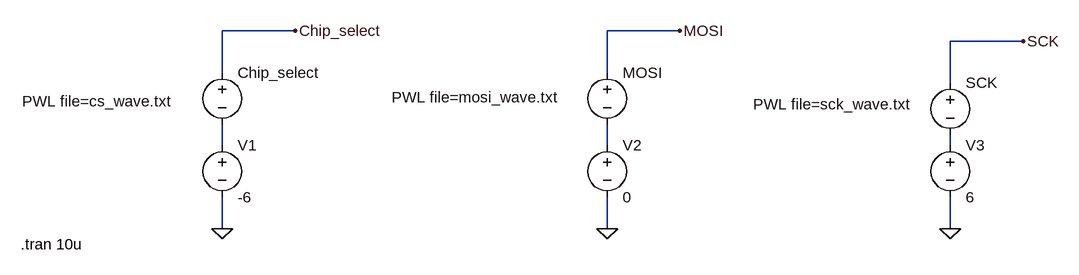
[diagram p0: schematic SPI_waveform_test.asc]
SPI_waveform_test.asc, the LTspice schematic file:
Version 4
SHEET 1 3484 1816
WIRE 144 -256 32 -256
WIRE 736 -256 624 -256
WIRE 1264 -240 1152 -240
WIRE 32 -192 32 -256
WIRE 624 -192 624 -256
WIRE 1152 -176 1152 -240
WIRE 32 -80 32 -112
WIRE 624 -80 624 -112
WIRE 1152 -80 1152 -96
WIRE 32 48 32 0
WIRE 624 48 624 0
WIRE 1152 48 1152 0
FLAG 624 48 0
FLAG 1152 48 0
FLAG 32 48 0
FLAG 736 -256 MOSI
FLAG 1264 -240 SCK
FLAG 144 -256 Chip_select
SYMBOL voltage 624 -208 R0
WINDOW 3 -331 54 Left 2
WINDOW 123 0 0 Left 0
WINDOW 39 0 0 Left 0
SYMATTR Value PWL file=mosi_wave.txt
SYMATTR InstName MOSI
SYMBOL voltage 1152 -192 R0
WINDOW 3 -303 49 Left 2
WINDOW 123 0 0 Left 0
WINDOW 39 0 0 Left 0
SYMATTR Value PWL file=sck_wave.txt
SYMATTR InstName SCK
SYMBOL voltage 32 -208 R0
WINDOW 3 -308 60 Left 2
WINDOW 123 0 0 Left 0
WINDOW 39 0 0 Left 0
SYMATTR Value PWL file=cs_wave.txt
SYMATTR InstName Chip_select
SYMBOL voltage 32 -96 R0
WINDOW 123 0 0 Left 0
WINDOW 39 0 0 Left 0
SYMATTR InstName V1
SYMATTR Value -6
SYMBOL voltage 624 -96 R0
WINDOW 123 0 0 Left 0
WINDOW 39 0 0 Left 0
SYMATTR InstName V2
SYMATTR Value 0
SYMBOL voltage 1152 -96 R0
WINDOW 123 0 0 Left 0
WINDOW 39 0 0 Left 0
SYMATTR InstName V3
SYMATTR Value 6
TEXT -278 72 Left 2 !.tran 10u

The netlist it stands for:
* SPI_waveform_test.asc
V§MOSI MOSI N002 PWL file=mosi_wave.txt
V§SCK SCK N003 PWL file=sck_wave.txt
V§Chip_select Chip_select N001 PWL file=cs_wave.txt
V1 N001 0 -6
V2 N002 0 0
V3 N003 0 6
.tran 10u
.backanno
.end

* Results of the author's LTspice run, read from the files saved beside the schematic
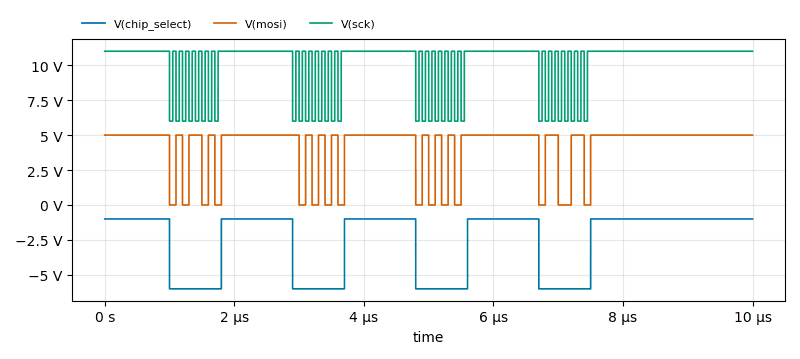
[diagram p1: Transient Analysis of SPI_waveform_test.asc, plotted from the saved traces]
* Transient Analysis, 1 run:
*   V(chip_select): min -6 V, max -1 V, average -2.6 V, rms 3.493 V, last -1 V
*   V(mosi): min 0 V, max 5 V, average 4.2 V, rms 4.583 V, last 5 V
*   V(sck): min 6 V, max 11 V, average 10.2 V, rms 10.36 V, last 11 V